# Altium project Audio_Docking_Station.PrjPcb
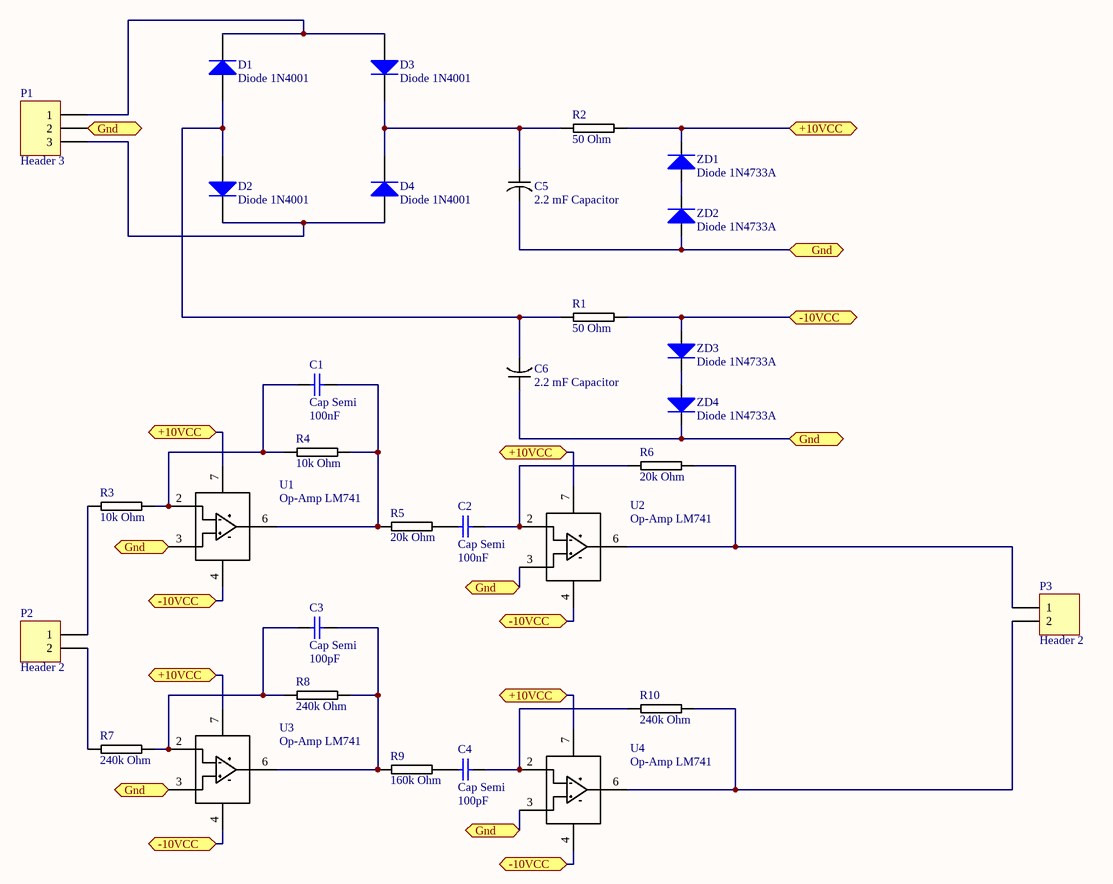
[diagram p0: Audio_Docking_Station.SchDoc]
1 sheet, 31 parts. Net scope: flat (ports and power ports of the same name join across sheets).
Board file: Audio_Docking_Station_PCB.PcbDoc

## Sheet Audio_Docking_Station.SchDoc
size A4

### Parts
C1  Cap Semi  value 100nF  [0402]
C2  Cap Semi  value 100nF  [0402]
C3  Cap Semi  value 100pF  [0402]
C4  Cap Semi  value 100pF  [0402]
C5  2.2 mF Capacitor  [2.2mF Capacitor]
C6  2.2 mF Capacitor  [2.2mF Capacitor]
D1  Diode 1N4001  [DO-41]
D2  Diode 1N4001  [DO-41]
D3  Diode 1N4001  [DO-41]
D4  Diode 1N4001  [DO-41]
P1  Header 3  [HDR1X3]
P2  Header 2  [HDR1X2]
P3  Header 2  [HDR1X2]
R1  50 Ohm  [0603R-TBD]
R2  50 Ohm  [0603R-TBD]
R3  10k Ohm  [0402R-TBD]
R4  10k Ohm  [0402R-TBD]
R5  20k Ohm  [0603R-TBD]
R6  20k Ohm  [0603R-TBD]
R7  240k Ohm  [0603R-TBD]
R8  240k Ohm  [0603R-TBD]
R9  160k Ohm  [0603R-TBD]
R10  240k Ohm  [0603R-TBD]
U1  Op-Amp LM741  [8-DIP]
U2  Op-Amp LM741  [8-DIP]
U3  Op-Amp LM741  [8-DIP]
U4  Op-Amp LM741  [8-DIP]
ZD1  Diode 1N4733A  [DO-41G]
ZD2  Diode 1N4733A  [DO-41G]
ZD3  Diode 1N4733A  [DO-41G]
ZD4  Diode 1N4733A  [DO-41G]

### Ports
+10VCC, -10VCC, Gnd

### Nets
NetC1_1: C1.1 R3.2 R4.1 U1.2
NetC1_2: C1.2 R4.2 R5.1 U1.6
NetC2_1: C2.1 R5.2
NetC2_2: C2.2 R6.1 U2.2
NetC3_1: C3.1 R7.2 R8.1 U3.2
NetC3_2: C3.2 R8.2 R9.1 U3.6
NetC4_1: C4.1 R9.2
NetC4_2: C4.2 R10.1 U4.2
NetC5_1: C5.1 C6.2 P1.2 U1.3 U2.3 U3.3 U4.3 ZD2.1 ZD4.2 ; port Gnd
NetC5_2: C5.2 D3.2(K) D4.2(K) R2.1
NetC6_1: C6.1 D1.1(A) D2.1(A) R1.1
NetD1_2: D1.2(K) D3.1(A) P1.1
NetD2_2: D2.2(K) D4.1(A) P1.3
NetP2_1: P2.1 R3.1
NetP2_2: P2.2 R7.1
NetP3_1: P3.1 R6.2 U2.6
NetP3_2: P3.2 R10.2 U4.6
NetR1_2: R1.2 U1.4 U2.4 U3.4 U4.4 ZD3.1 ; port -10VCC
NetR2_2: R2.2 U1.7 U2.7 U3.7 U4.7 ZD1.2 ; port +10VCC
NetZD1_1: ZD1.1 ZD2.2
NetZD3_2: ZD3.2 ZD4.1

### Library data of the parts
C1-C4 = Cap Semi: Capacitor (Semiconductor SIM Model); Published: 8-Jun-2000; LatestRevisionDate: 29-May-2009; LatestRevisionNote: IPC-7351 Footprint Added.; PackageReference: C1206; Publisher: Altium Limited; PackageDescription: Chip Capacitor
D1-D4 = Diode 1N4001: 1 Amp General Purpose Rectifier; Published: 8-Jun-2000; LatestRevisionDate: 17-Jul-2002; LatestRevisionNote: Re-released for DXP Platform.; DatasheetVersion: 1998; PackageVersion: Aug-1999; PackageReference: DO-41; Publisher: Altium Limited; PackageDescription: Diode, Axial; Body 5.2 x 2.7 mm (LxDia. max), Lead Dia. 0.86 mm (max); Code_JEDEC: DO-204-AL; ComponentLink1Description: Manufacturer Link; ComponentLink1URL: http://www.fairchildsemi.com/; ComponentLink2Description: Datasheet; ComponentLink2URL: http://www.fairchildsemi.com/ds/1N%2F1N4001.pdf
P1 = Header 3: Header, 3-Pin; LatestRevisionDate: 17-Jul-2002; LatestRevisionNote: Re-released for DXP Platform.; Publisher: Altium Limited
P2 P3 = Header 2: Header, 2-Pin; LatestRevisionDate: 17-Jul-2002; LatestRevisionNote: Re-released for DXP Platform.; Publisher: Altium Limited
R1 = 0603R-TBD: RESISTOR 0603; Value: 50
R2 = 0603R-TBD: RESISTOR 0603 VALUE TO BE DETERMINED; Value: 50
R3 R4 = 0402R-TBD: Value: 10k
R5-R10 = 0603R-TBD: RESISTOR 0603
  R5 R6: Value: 20k
  R7 R8 R10: Value: 240k
  R9: Value: 160k